# EAGLE design vssb_324 (EAGLE 7.1.0)
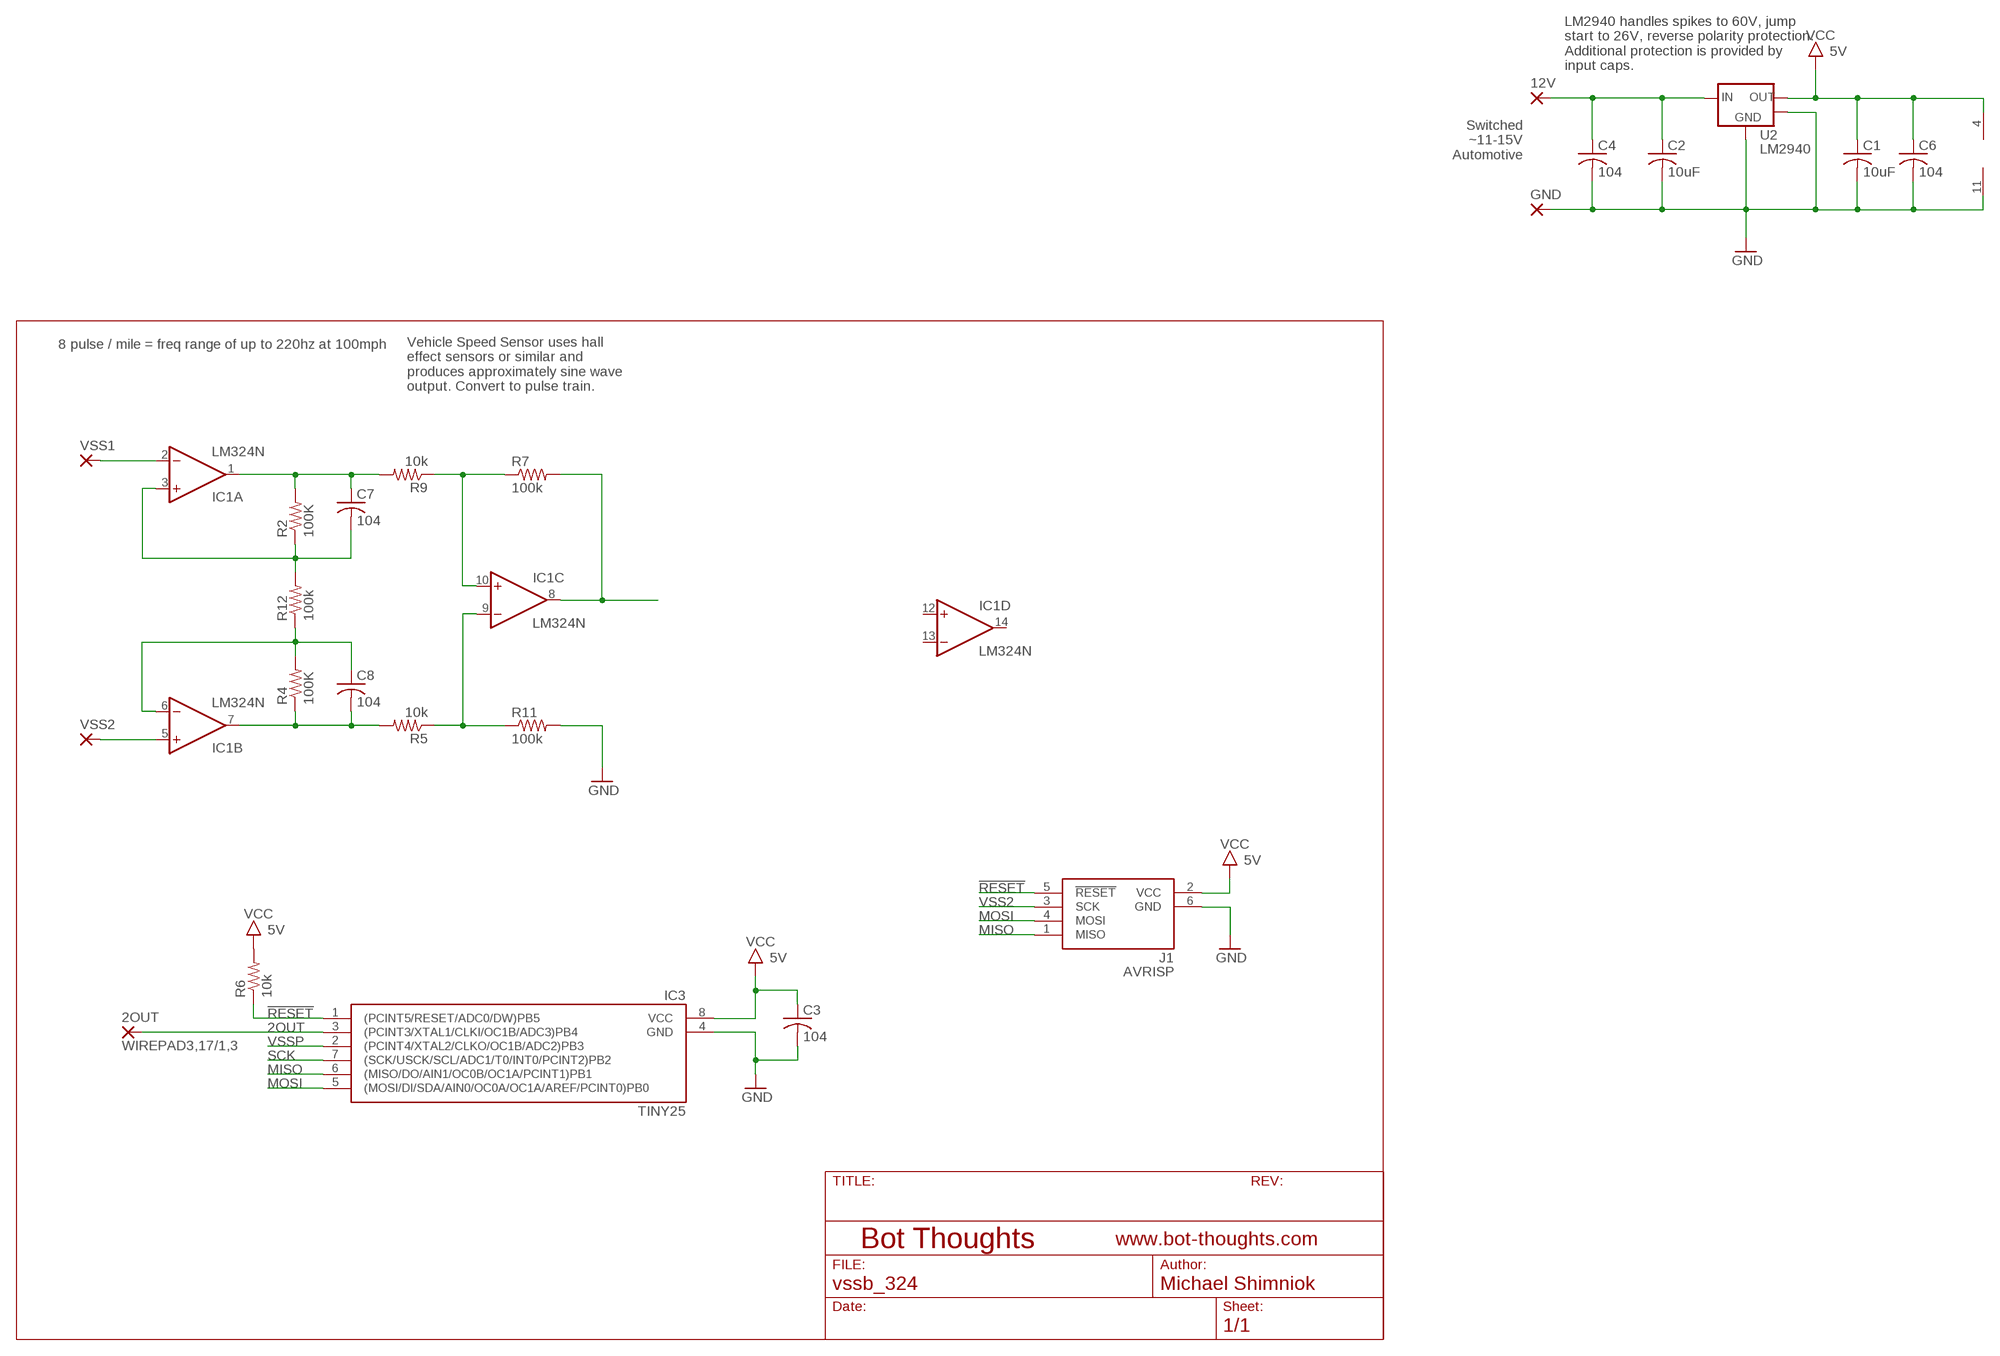
[diagram p0: schematic, sheet 1]

## Parts
2OUT  WIREPAD3,17/1,3  [3,17/1,3]
12V  WIREPAD3,17/1,3  [3,17/1,3]
C1  10uF  C-USC1206  [C1206]
C2  10uF  C-USC1206  [C1206]
C3  104  C-USC0603  [C0603]
C4  104  C-USC0603  [C0603]
C6  104  C-USC0603  [C0603]
C7  104  C-USC0603  [C0603]
C8  104  C-USC0603  [C0603]
GND  WIREPAD3,17/1,3  [3,17/1,3]
IC1  LM324N  [DIL14]
IC3  TINY25  TINY25/45/85-20PU  [DIL08]
J1  AVRISP  AVRISP6_COMPACT  [CON6P2R]
R2  100K  R-US_R0603  [R0603]
R4  100K  R-US_R0603  [R0603]
R5  10k  R-US_R0603  [R0603]
R6  10k  R-US_R0603  [R0603]
R7  100k  R-US_R0603  [R0603]
R9  10k  R-US_R0603  [R0603]
R11  100k  R-US_R0603  [R0603]
R12  100k  R-US_R0603  [R0603]
U2  LM2940  LM2940KTT  [TO263-3]
VSS1  WIREPAD3,17/1,3  [3,17/1,3]
VSS2  WIREPAD3,17/1,3  [3,17/1,3]

## Nets
2OUT: 2OUT.1(P) IC3.3((PCINT3/XTAL1/CLKI/OC1B/ADC3)PB4)
12-15V: 12V.1(P) C2.1 C4.1 U2.1(VIN)
!RESET: IC3.1((PCINT5/RESET/ADC0/DW)PB5) J1.5(!RESET) R6.1
GND: C1.2 C2.2 C3.2 C4.2 C6.2 GND.1(P) IC1.11(P:V-) IC3.4(GND) J1.6(GND) R11.2 U2.2(GND) U2.4(TAB)
MISO: IC3.6((MISO/DO/AIN1/OC0B/OC1A/PCINT1)PB1) J1.1(MISO)
MOSI: IC3.5((MOSI/DI/SDA/AIN0/OC0A/OC1A/AREF/PCINT0)PB0) J1.4(MOSI)
N$5: C8.1 IC1.6(B:-IN) R4.2 R12.1
N$6: C7.2 IC1.3(A:+IN) R2.1 R12.2
N$7: IC1.8(C:OUT) R7.2
N$8: C7.1 IC1.1(A:OUT) R2.2 R9.2
N$9: C8.2 IC1.7(B:OUT) R4.1 R5.2
N$10: IC1.10(C:+IN) R7.1 R9.1
N$11: IC1.9(C:-IN) R5.1 R11.1
SCK: IC3.7((SCK/USCK/SCL/ADC1/T0/INT0/PCINT2)PB2)
VCC: C1.1 C3.1 C6.1 IC1.4(P:V+) IC3.8(VCC) J1.2(VCC) R6.2 U2.3(VOUT) ; supply symbol labelled 5V
VSS1: IC1.2(A:-IN) VSS1.1(P)
VSS2: IC1.5(B:+IN) J1.3(SCK) VSS2.1(P)
VSSP: IC3.2((PCINT4/XTAL2/CLKO/OC1B/ADC2)PB3)
Unconnected: IC1.12(D:+IN) IC1.13(D:-IN) IC1.14(D:OUT)

## Notes on the sheet
- LM2940 handles spikes to 60V, jump
  start to 26V, reverse polarity protection.
  Additional protection is provided by
  input caps.
- Switched
  ~11-15V
  Automotive
- 8 pulse / mile = freq range of up to 220hz at 100mph
- Vehicle Speed Sensor uses hall
  effect sensors or similar and
  produces approximately sine wave
  output. Convert to pulse train.

## Library data of the parts
2OUT 12V GND VSS1 VSS2 = wirepad:WIREPAD: Wire PAD connect wire on PCB
C1-C4 C6-C8 = rcl:C-US: CAPACITOR, American symbol
IC1 = linear:LM324: OP AMP
IC3 = bt_avr:TINY25/45/85: Atmel AVR ATiny25,45,85 8-bit Microcontroller
J1 = bt_avr:AVRISP6: 6-pin dual-row connector for Atmel AVRISP programmer interface
R2 R4-R7 R9 R11 R12 = rcl:R-US_: RESISTOR, American symbol
U2 = bt_regulator:LM2940: LM2940 LDO Voltage Regulator The LM2940-N/LM2940C positive voltage regulator features the ability to source 1A of output current with a dropout voltage of typically 0.5V and a maximum of 1V over the entire temperature range. Furthermore, a quiescent current reduction circuit has been included which reduces the ground current when the differential between the input voltage and the output exceeds approximately 3V. Designed also for vehicular applications, the LM2940-N/LM2940C and all regulated circuitry are protected from reverse battery installations or 2-battery jumps. During line transients, such as load dump when the input voltage can momentarily exceed the specified maximum operating voltage, the regulator will automatically shut down to protect both the internal circuits and the load. The LM2940/LM2940C cannot be harmed by temporary mirror-image insertion. Familiar regulator features such as short circuit and thermal overload protection are also provided. Datasheet.pdf <http://www.ti.com/lit/ds/symlink/lm2940-n.pdf>

## Board
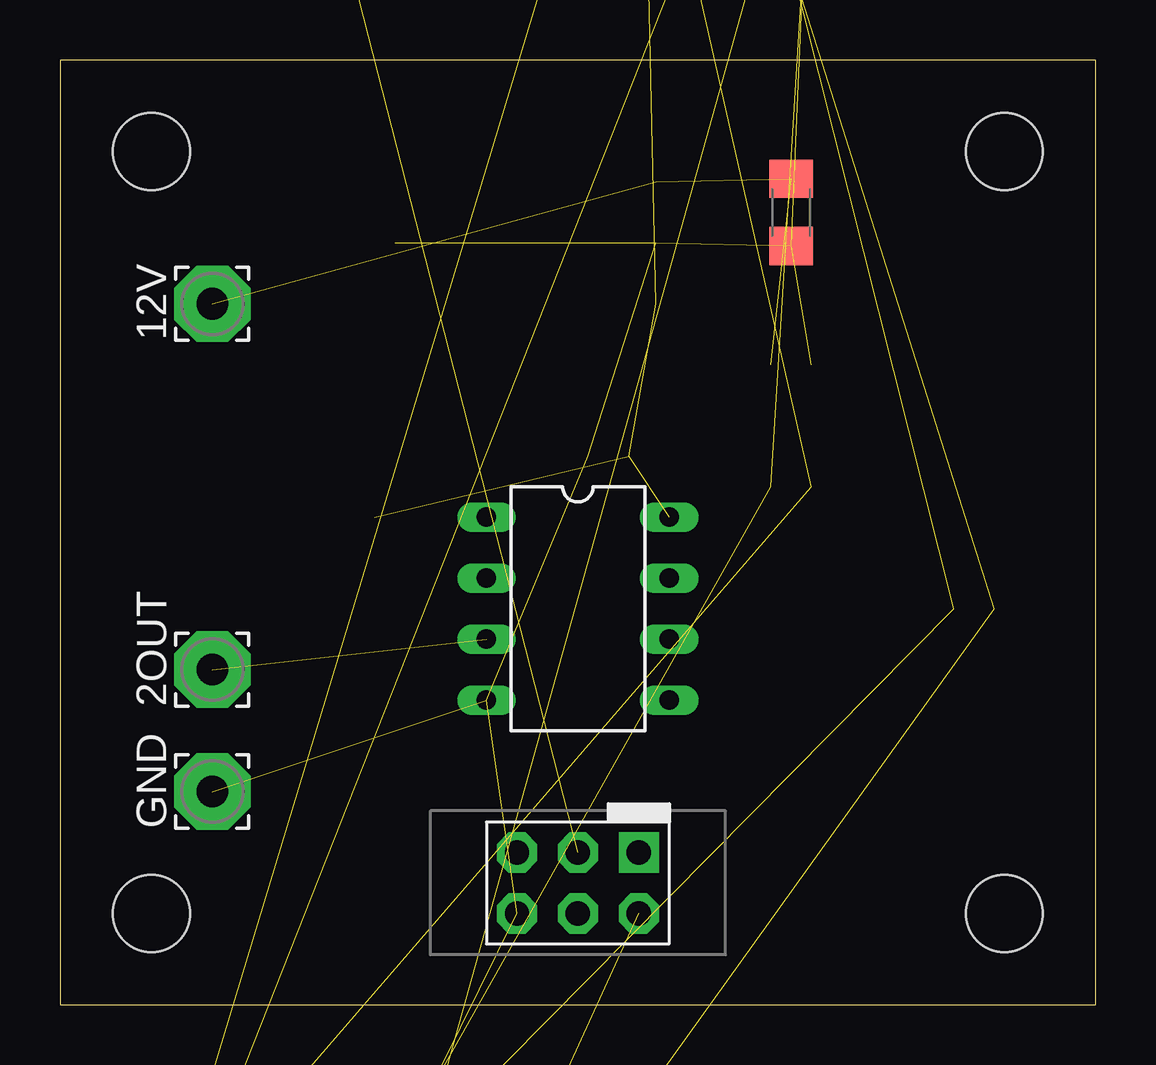
[diagram p1: board, top side]
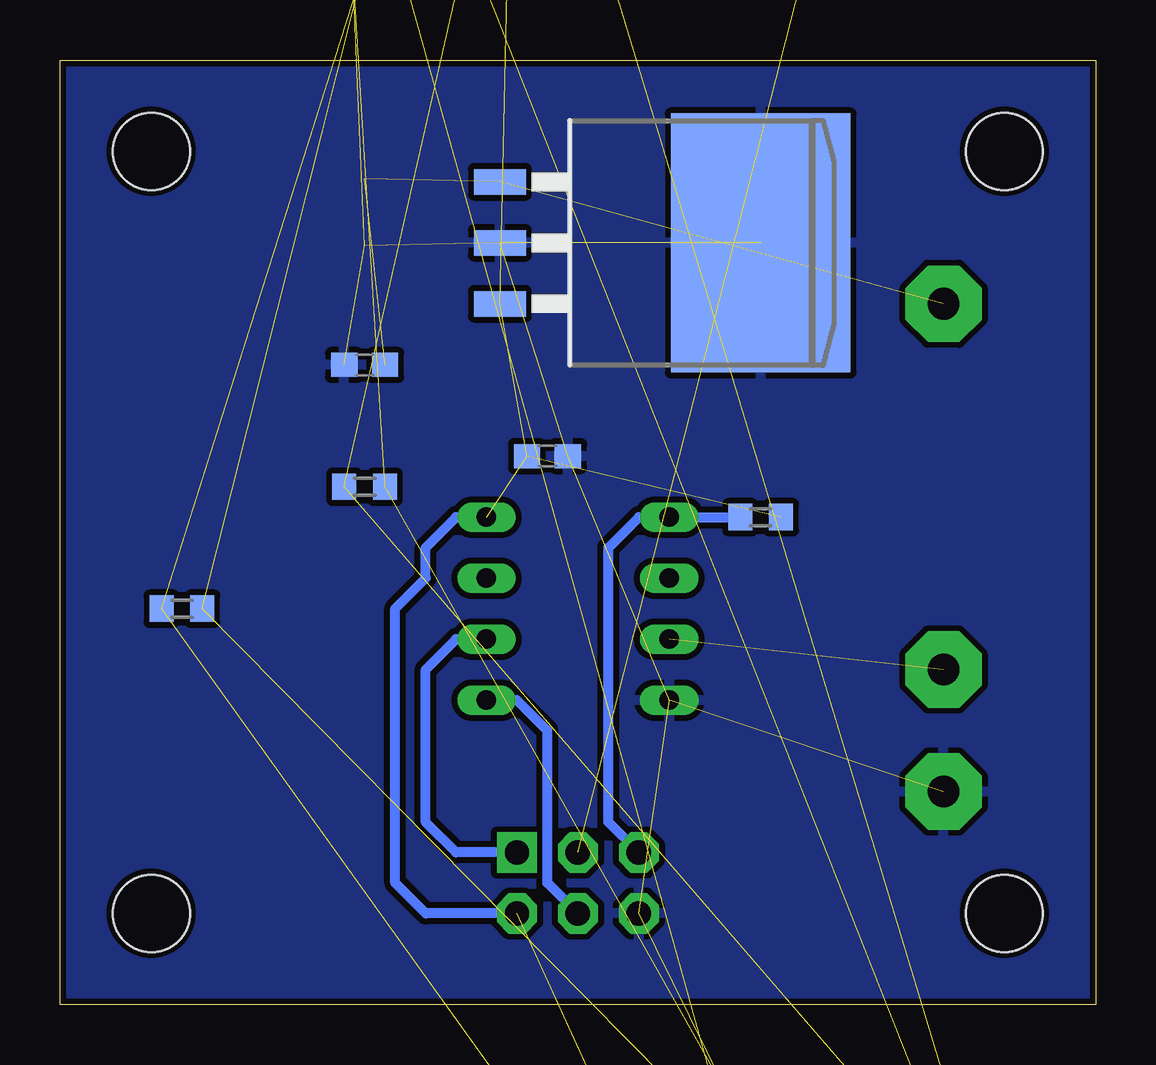
[diagram p2: board, bottom side, seen from below]

Size 43.18 x 39.37 mm. Coordinates in mm from the lower left corner, seen from the top.
Outline: 0,0 43.18,0 43.18,39.37 0,39.37 0,0
Copper layers (1*16): Top 0.0356mm / dielectric 1.5011mm / Bottom 0.0356mm
Design rules "LaenPCBOrder": minimum track width 6mil, minimum drill 13mil, track to track 10mil, track to pad 10mil, pad to pad 10mil, via to via 10mil, smd to smd 8mil, copper to edge 10mil, drill to drill 10mil, minimum pad ring 7mil, minimum via ring 7mil, stop-mask expansion 3mil, vias tented up to drill 20mil, thermal gap 10mil
Holes 3.2 mm at 3.81,35.56 39.37,35.56 39.37,3.81 3.81,3.81

### Footprints (pad centres in the part's own frame; a part is rotated, then mirrored left to right if it is on the bottom)
3,17/1,3 = drill 1.321 pad 3.175 octagon: 1 0,0
C1206 = smd 1.6 x 1.8: 1 -1.4,0; 2 1.4,0
C0603 = smd 1.1 x 1: 1 -0.85,0; 2 0.85,0
DIL14 = drill 0.813 long: 1 -7.62,-3.81; 2 -5.08,-3.81; 3 -2.54,-3.81; 4 0,-3.81; 5 2.54,-3.81; 6 5.08,-3.81; 7 7.62,-3.81; 8 7.62,3.81; 9 5.08,3.81; 10 2.54,3.81; 11 0,3.81; 12 -2.54,3.81; 13 -5.08,3.81; 14 -7.62,3.81
DIL08 = drill 0.813 long: 1 -3.81,-3.81; 2 -1.27,-3.81; 3 1.27,-3.81; 4 3.81,-3.81; 5 3.81,3.81; 6 1.27,3.81; 7 -1.27,3.81; 8 -3.81,3.81
CON6P2R = drill 1.016 pad 1.676 square: 1 -2.54,-1.27 | drill 1.016 pad 1.676 octagon: 2 -2.54,1.27; 3 0,-1.27; 4 0,1.27; 5 2.54,-1.27; 6 2.54,1.27
R0603 = smd 1 x 1.1: 1 -0.85,0; 2 0.85,0
TO263-3 = smd 1.067 x 2.159: 1 -2.54,-7.061; 2 0,-7.061; 3 2.54,-7.061 | smd 10.795 x 7.493: 4 0,3.81

### Placement (x,y rotation side)
2OUT  6.35,13.97 90 top
12V  6.35,29.21 90 top
C1  -6.35,-66.04 0 top  (outside the outline)
C2  30.48,33.02 270 top
C3  22.86,22.86 0 bottom
C4  30.48,26.67 180 bottom
C6  -7.62,-72.39 0 top  (outside the outline)
C7  2.54,-38.1 0 top  (outside the outline)
C8  2.54,-43.18 0 top  (outside the outline)
GND  6.35,8.89 90 top
IC1  27.94,60.96 270 top  (outside the outline)
IC3  21.59,16.51 270 top
J1  21.59,5.08 180 top
R2  38.1,16.51 0 bottom
R4  2.54,-12.7 0 top  (outside the outline)
R5  30.48,21.59 180 bottom
R6  13.97,20.32 0 bottom
R7  2.54,-48.26 0 top  (outside the outline)
R9  2.54,-17.78 0 top  (outside the outline)
R11  2.54,-27.94 0 top  (outside the outline)
R12  2.54,-33.02 0 top  (outside the outline)
U2  17.78,31.75 270 bottom
VSS1  8.89,67.31 90 top  (outside the outline)
VSS2  8.89,55.88 90 top  (outside the outline)

### Tracks (layer width: path | path; a pad name or v marks a point on that pad's centre or on a via)
2OUT  (1 unrouted)
12-15V  (3 unrouted)
!RESET
  Bottom 0.406: R6.1 IC3.1 19.05,20.32 20.32,19.05 20.32,7.62 J1.5
GND  (11 unrouted)
  pour Bottom: 0,39.37 43.18,39.37 43.18,0 0,0
MISO
  Bottom 0.406: J1.1 26.67,6.35 27.94,7.62 27.94,13.97 26.67,15.24 IC3.6
MOSI
  Bottom 0.406: J1.4 22.86,5.08 22.86,11.43 24.13,12.7 IC3.5
N$5  (3 unrouted)
N$6  (3 unrouted)
N$7  (1 unrouted)
N$8  (3 unrouted)
N$9  (3 unrouted)
N$10  (2 unrouted)
N$11  (2 unrouted)
VCC  (6 unrouted)
  Bottom 0.406: J1.2 27.94,3.81 29.21,5.08 29.21,16.51 27.94,17.78 27.94,19.05 26.67,20.32 IC3.8
VSS1  (1 unrouted)
VSS2  (2 unrouted)